# EAGLE design Tesseract_SERVO_Vero (12x12) (EAGLE 7.7.0)

## Sheet 1 of 2

## Sheet 2 of 2
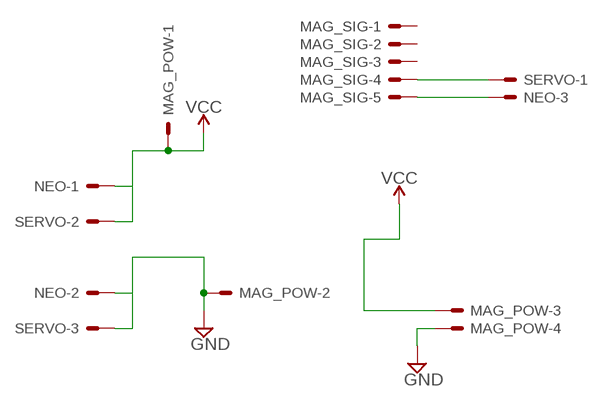
[diagram p0: schematic, sheet 2]

### Parts
MAG_POW  JST-XH-04-PIN-LONG-PAD  [JST-XH-04-PACKAGE-LONG-PAD]
MAG_SIG  JST-XH-05-PIN-LONG-PAD  [JST-XH-05-PACKAGE-LONG-PAD]
NEO  JST-XH-03-PIN-LONG-PAD  [JST-XH-03-PACKAGE-LONG-PAD]
SERVO  JST-XH-03-PIN-LONG-PAD  [JST-XH-03-PACKAGE-LONG-PAD]

### Nets
5V_GND: MAG_POW.2 NEO.2 SERVO.3 ; supply symbol labelled GND
5V_VCC: MAG_POW.1 NEO.1 SERVO.2 ; supply symbol labelled VCC
12V_GND: MAG_POW.4 ; supply symbol labelled GND
12V_VCC: MAG_POW.3 ; supply symbol labelled VCC
PIN6: MAG_SIG.4 SERVO.1
PIN7: MAG_SIG.5 NEO.3
Unconnected: MAG_SIG.1 MAG_SIG.2 MAG_SIG.3

## Library data of the parts
MAG_POW = Rembrandt Electronics - JST XH Connectors v1-0:JST-XH-04-PIN: JST XH Connector 2 Pin Wire to board connector. Pitch: 2,54 mm, (0.100") Number of pins: 4 Created by Rembrandt Electronics www.rembrandtelectronics.com
MAG_SIG = Rembrandt Electronics - JST XH Connectors v1-0:JST-XH-05-PIN: JST XH Connector 2 Pin Wire to board connector. Pitch: 2,54 mm, (0.100") Number of pins: 5 Created by Rembrandt Electronics www.rembrandtelectronics.com
NEO SERVO = Rembrandt Electronics - JST XH Connectors v1-0:JST-XH-03-PIN: JST XH Connector 2 Pin Wire to board connector. Pitch: 2,54 mm, (0.100") Number of pins: 3 Created by Rembrandt Electronics www.rembrandtelectronics.com

## Board
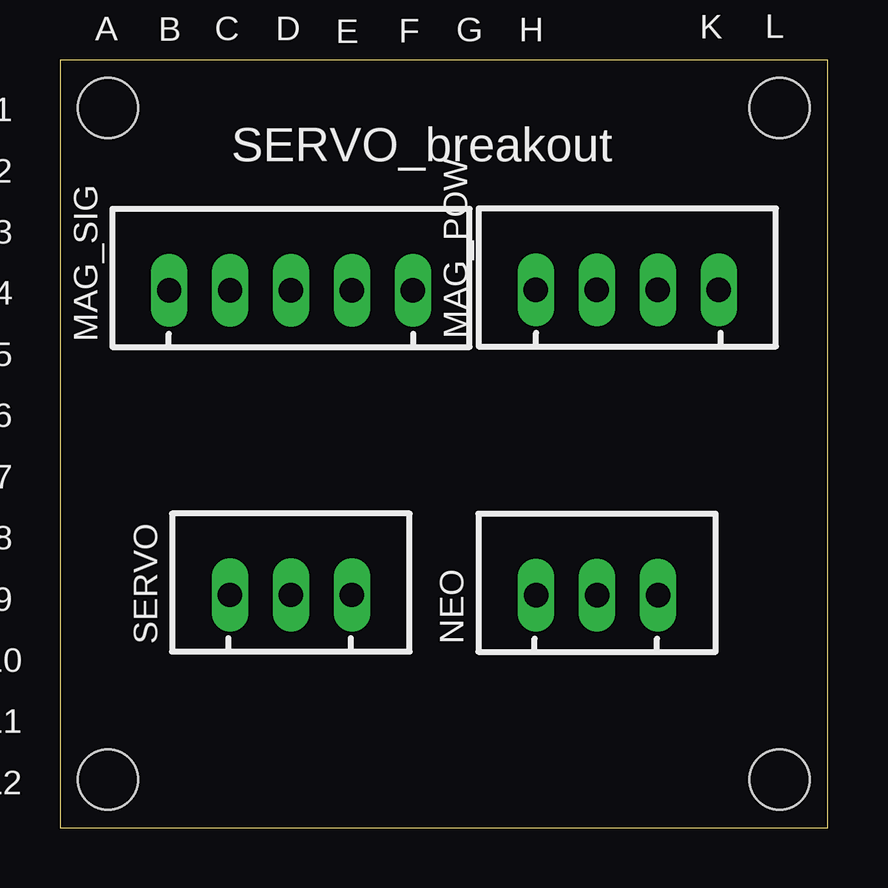
[diagram p1: board, top side]
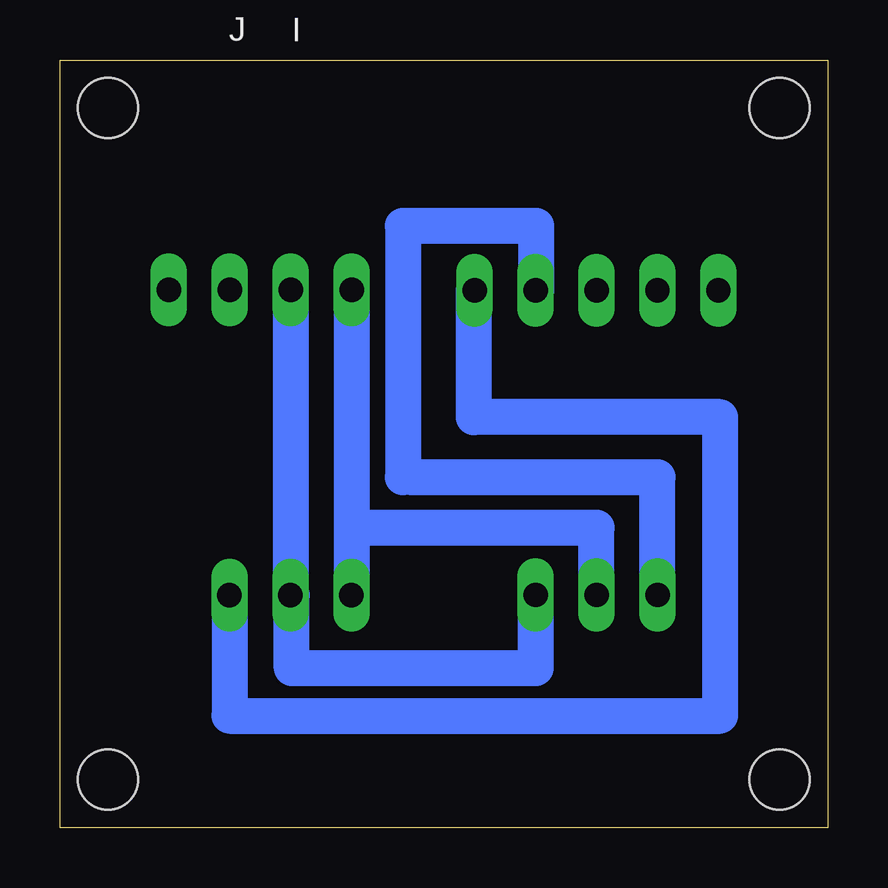
[diagram p2: board, bottom side, seen from below]

Size 32 x 32 mm. Coordinates in mm from the lower left corner, seen from the top.
Outline: 0,0 32,0 32,32 0,32 0,0
Copper layers (1*16): Top 0.035mm / dielectric 1.5mm / Bottom 0.035mm
Design rules "default": minimum track width 10mil, minimum drill 24mil, track to track 8mil, track to pad 8mil, pad to pad 8mil, via to via 8mil, smd to smd 8mil, copper to edge 40mil, drill to drill 8mil, minimum pad ring 10mil, minimum via ring 8mil, stop-mask expansion 4mil, vias tented up to drill 0mil, thermal gap 10mil
Holes 2.5 mm at 30,2 2,2 30,30 2,30

### Footprints (pad centres in the part's own frame; a part is rotated, then mirrored left to right if it is on the bottom)
JST-XH-04-PACKAGE-LONG-PAD = drill 1.016 long: 1 -3.81,0; 2 -1.27,0; 3 1.27,0; 4 3.81,0
JST-XH-05-PACKAGE-LONG-PAD = drill 1.016 long: 1 -5.08,0; 2 -2.54,0; 3 0,0; 4 2.54,0; 5 5.08,0
JST-XH-03-PACKAGE-LONG-PAD = drill 1.016 long: 1 -2.54,0; 2 0,0; 3 2.54,0

### Placement (x,y rotation side)
MAG_POW  23.65,22.42 0 top
MAG_SIG  9.63,22.39 0 top
NEO  22.39,9.69 0 top
SERVO  9.63,9.7 0 top
U$15  [12X12]  16,30 0 top

### Tracks (layer width: path | path; a pad name or v marks a point on that pad's centre or on a via)
5V_GND
  Bottom 0.406: NEO.2 22.34,9.69
  Bottom 1.5: MAG_POW.2 NEO.2 | SERVO.3 12.17,6.64 22.34,6.64 22.34,9.69
5V_VCC
  Bottom 0.406: 19.84,9.69 NEO.1
  Bottom 1.5: MAG_POW.1 19.84,12.5 | 19.84,12.5 19.84,9.69 | SERVO.2 9.63,12.5 19.84,12.5
PIN6
  Bottom 0.406: 17.33,14.6 17.49,14.6 17.7,14.6 | 12.15,22.39 MAG_SIG.4
  Bottom 1.5: SERVO.1 7.09,14.6 17.33,14.6 | 12.15,22.39 12.15,25.07 17.7,25.07 17.7,14.6
PIN7
  Bottom 0.406: 14.74,22.39 MAG_SIG.5
  Bottom 1.5: NEO.3 24.93,4.67 4.48,4.67 4.48,17.11 14.74,17.11 14.74,22.39

### Text on the board
tPlace: A | B | C | D | E | F | G | H | K | L | 1 / 2 / 3 / 4 / 5 / 6 / 7 / 8 / 9 / 10 / 11 / 12
bPlace: I | J
tNames: SERVO_breakout